# EasyEDA Pro project ProProject_2024省电H题小车_2024-08-25.epro

# Schematic 电赛小车底板原理图
Create Date: 2024-08-21; Page Name: P1; Project Name: 2024省电H题小车; Schematic Name: 电赛小车底板原理图; Update Date: 2024-08-22; Company: 华南师范大学; Drawed: Jacky_L; Page Size: A4; Version: V1.0
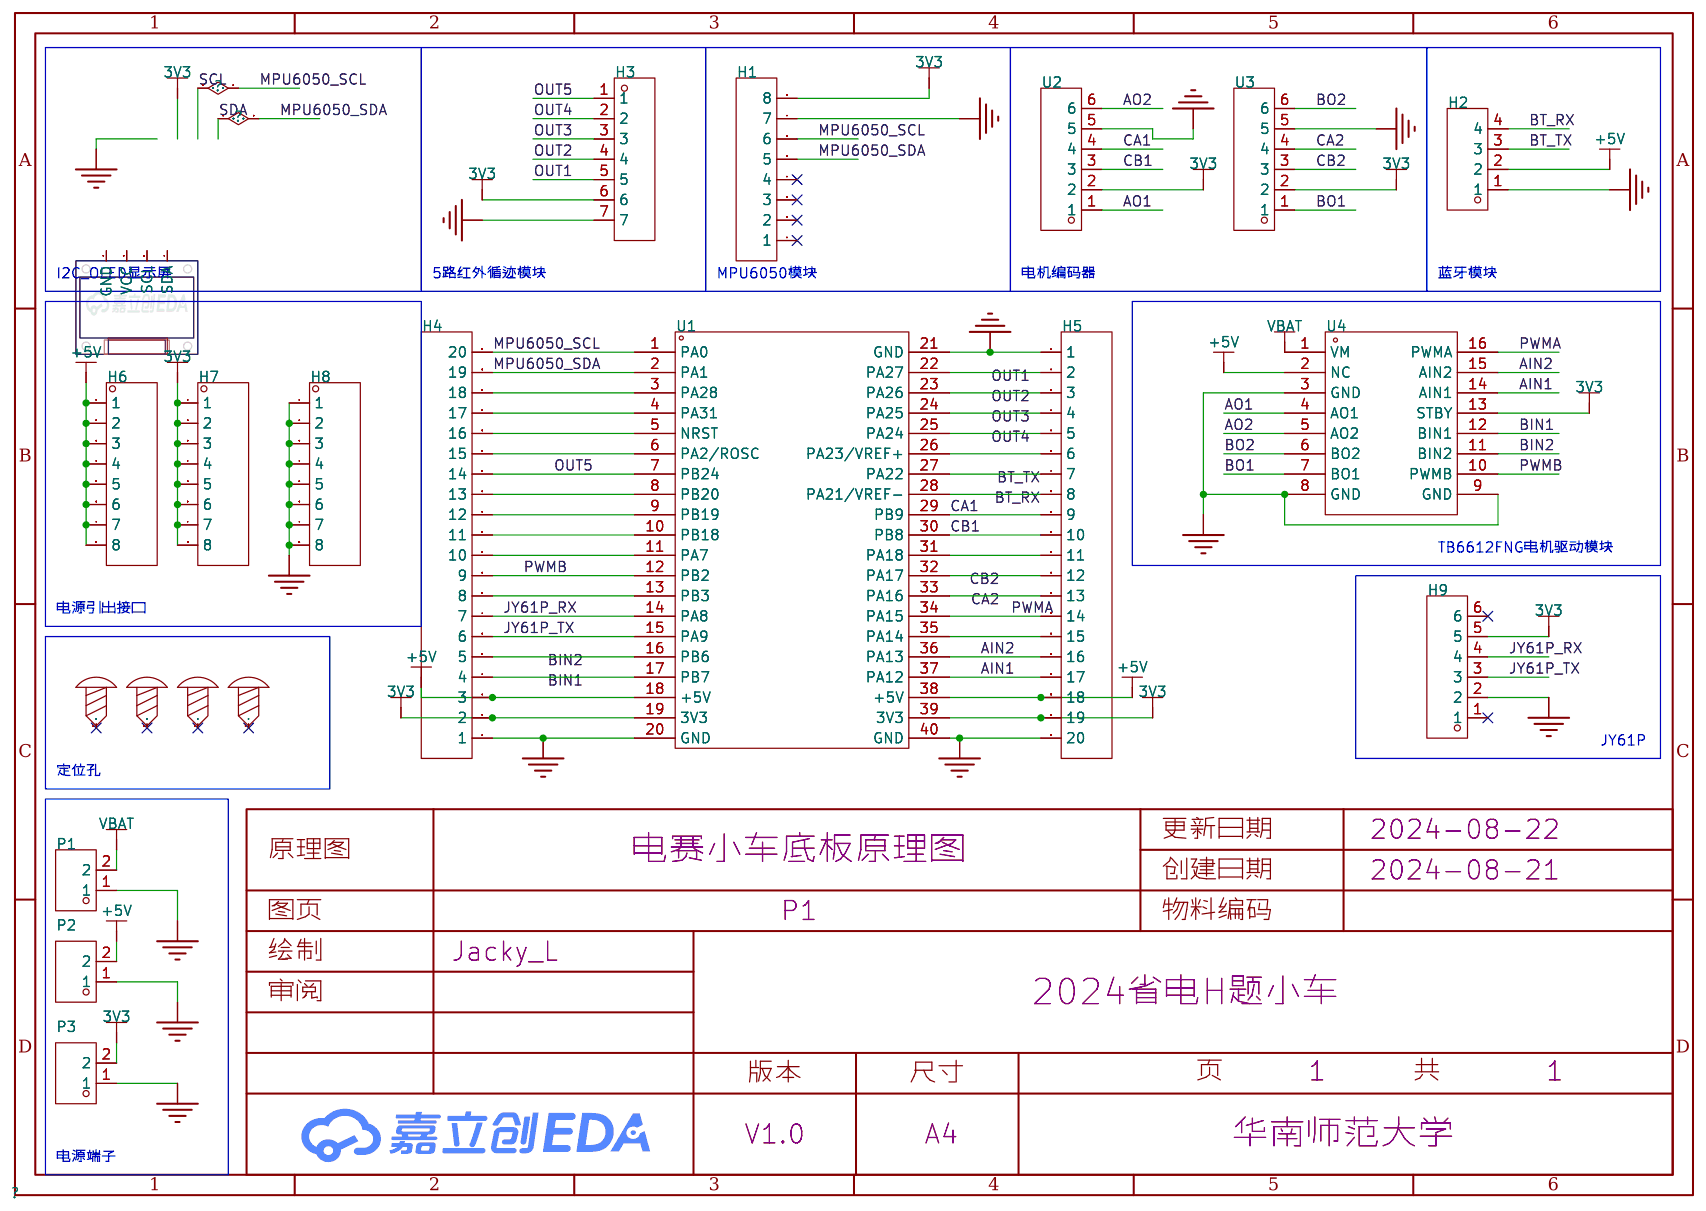
[diagram p0: schematic sheet]

## Parts
H1  -  [HDR-TH_8P-P2.54-V-F-1]
H2  -  [HDR-TH_4P-P2.54-V-F]
H3  -  [HDR-TH_7P-P2.54-V-M]
H4  -  [HDR-TH_20P-P2.54-V-F]
H5  -  [HDR-TH_20P-P2.54-V-F]
H6  -  [HDR-TH_8P-P2.54-V-M]
H7  -  [HDR-TH_8P-P2.54-V-M]
H8  -  [HDR-TH_8P-P2.54-V-M]
H9  -  [HDR-TH_6P-P2.54-V-F]
OLED  -  [0.96OLED_4P]
P1  KF301-2P接线端子  [CONN-TH_XY301V-A-5.0-2P]
P2  KF301-2P接线端子  [CONN-TH_XY301V-A-5.0-2P]
P3  KF301-2P接线端子  [CONN-TH_XY301V-A-5.0-2P]
SCREW1  -  [M3螺丝]
SCREW2  -  [M3螺丝]
SCREW3  -  [M3螺丝]
SCREW4  -  [M3螺丝]
U1  -  [立创地猛星MSPM0G3507开发板]
U2  ZX-XH2.54-6PZZ  [CONN-TH_6P-P2.50_ZX-XH2.54-6PZZ]
U3  ZX-XH2.54-6PZZ  [CONN-TH_6P-P2.50_ZX-XH2.54-6PZZ]
U4  -  [TB6612FNG成品板]

## Library data of the parts
H1 = HDR-F_2.54_1x8P: Supplier Part: C27438; Supplier Footprint: 插件
H2 = HDR-F_2.54_1x4P: Supplier Part: C2718488; Supplier Footprint: 插件
H3 = HDR-M_2.54_1x7P: Supplier Part: C492406; Supplier Footprint: 插件
H4 H5 = HDR-F_2.54_1x20P: Supplier Part: C50984; Supplier Footprint: 插件
H6-H8 = HDR-M_2.54_1x8P: Supplier Part: C124381; Supplier Footprint: 插件
H9 = HDR-F_2.54_1x6P: Supplier Part: C40877; Supplier Footprint: 插件
OLED = 0.96OLED模块_4P: Supplier Footprint: 插件
P1-P3 = KF301-2P接线端子: Supplier Part: C9900016950; Supplier Footprint: CK301-2P; JLCPCB Part Class: 扩展库; Supplier: LCSC
SCREW1-SCREW4 = M3螺丝: Supplier Footprint: 插件
U1 = 立创地猛星MSPM0G3507最小系统板
U2 U3 = ZX-XH2.54-6PZZ: 插针结构:1x6P;间距:2.54mm;安装方式:直插;参考系列:XH;总PIN数:6P;排数:1;每排PIN数:6;行距:-;额定电流:3A;触头材质:黄铜;触头镀层:锡;工作温度范围:-25℃~+85℃;; Supplier Part: C7429636; Manufacturer: Megastar(兆星); Supplier Footprint: 插件,P=2.54mm; JLCPCB Part Class: 扩展库; Datasheet: https://atta.szlcsc.com/upload/public/pdf/source/20230619/1243AD0A516E39CD3D274D8985780568.pdf; Supplier: LCSC; Pins Structure: 1x6P; Pitch: 2.54mm; Mounting Style: 直插; Reference Series: XH; Number of Pins: 6P; Number of Rows: 1; Number of PINs Per Row: 6; Current Rating (Max): 3A; Contact Material: 黄铜; Contact Plating: 锡; Operating Temperature Range: -25℃~+85℃
U4 = TB6612FNG成品板

## Nets
3V3: H1.8 H3.6 H4.2 H5.19 H7.1 H7.2 H7.3 H7.4 H7.5 H7.6 H7.7 H7.8 H9.5 P3.2 U1.19(3V3) U1.39(3V3) U2.2 U3.2 U4.13(STBY)
+5V: H2.2 H4.3 H5.18 H6.1 H6.2 H6.3 H6.4 H6.5 H6.6 H6.7 H6.8 P2.2 U1.18(+5V) U1.38(+5V) U4.2(NC)
GND: H1.7 H2.1 H3.7 H4.1 H5.1 H5.20 H8.1 H8.2 H8.3 H8.4 H8.5 H8.6 H8.7 H8.8 H9.2 P1.1 P2.1 P3.1 U1.20(GND) U1.21(GND) U1.40(GND) U2.5 U3.5 U4.3(GND) U4.8(GND) U4.9(GND)
VBAT: P1.2 U4.1(VM)
AIN1: H5.17 U1.37(PA12) U4.14(AIN1)
AIN2: H5.16 U1.36(PA13) U4.15(AIN2)
AO1: U2.1 U4.4(AO1)
AO2: U2.6 U4.5(AO2)
BIN1: H4.4 U1.17(PB7) U4.12(BIN1)
BIN2: H4.5 U1.16(PB6) U4.11(BIN2)
BO1: U3.1 U4.7(BO1)
BO2: U3.6 U4.6(BO2)
BT_RX: H2.4 H5.8 U1.28(PA21/VREF-)
BT_TX: H2.3 H5.7 U1.27(PA22)
CA1: H5.9 U1.29(PB9) U2.4
CA2: H5.13 U1.33(PA16) U3.4
CB1: H5.10 U1.30(PB8) U2.3
CB2: H5.12 U1.32(PA17) U3.3
JY61P_RX: H4.7 H9.4 U1.14(PA8)
JY61P_TX: H4.6 H9.3 U1.15(PA9)
MPU6050_SCL: H1.6 H4.20 U1.1(PA0)
MPU6050_SDA: H1.5 H4.19 U1.2(PA1)
OUT1: H3.5 H5.2 U1.22(PA27)
OUT2: H3.4 H5.3 U1.23(PA26)
OUT3: H3.3 H5.4 U1.24(PA25)
OUT4: H3.2 H5.5 U1.25(PA24)
OUT5: H3.1 H4.14 U1.7(PB24)
PWMA: H5.14 U1.34(PA15) U4.16(PWMA)
PWMB: H4.9 U1.12(PB2) U4.10(PWMB)
$1N424: H5.15 U1.35(PA14)
$1N436: H5.11 U1.31(PA18)
$1N451: H5.6 U1.26(PA23/VREF+)
$1N2846: H4.8 U1.13(PB3)
$1N2850: H4.10 U1.11(PA7)
$1N2852: H4.11 U1.10(PB18)
$1N2854: H4.12 U1.9(PB19)
$1N2856: H4.13 U1.8(PB20)
$1N2860: H4.15 U1.6(PA2/ROSC)
$1N2862: H4.16 U1.5(NRST)
$1N2864: H4.17 U1.4(PA31)
$1N2866: H4.18 U1.3(PA28)

Not connected (* = marked no-connect by the designer): H1 1* 2* 3* 4*; H9 1* 6*; OLED 1(GND) 2(VCC) 3(SCL) 4(SDA); SCREW1 1*; SCREW2 1*; SCREW3 1*; SCREW4 1*

## Notes on the sheet
- I2C_OLED显示屏
- 5路红外循迹模块
- MPU6050模块
- 电机编码器
- 蓝牙模块
- TB6612FNG电机驱动模块
- 电源引出接口
- JY61P
- 定位孔
- 电源端子

# Board 电赛小车底版PCB
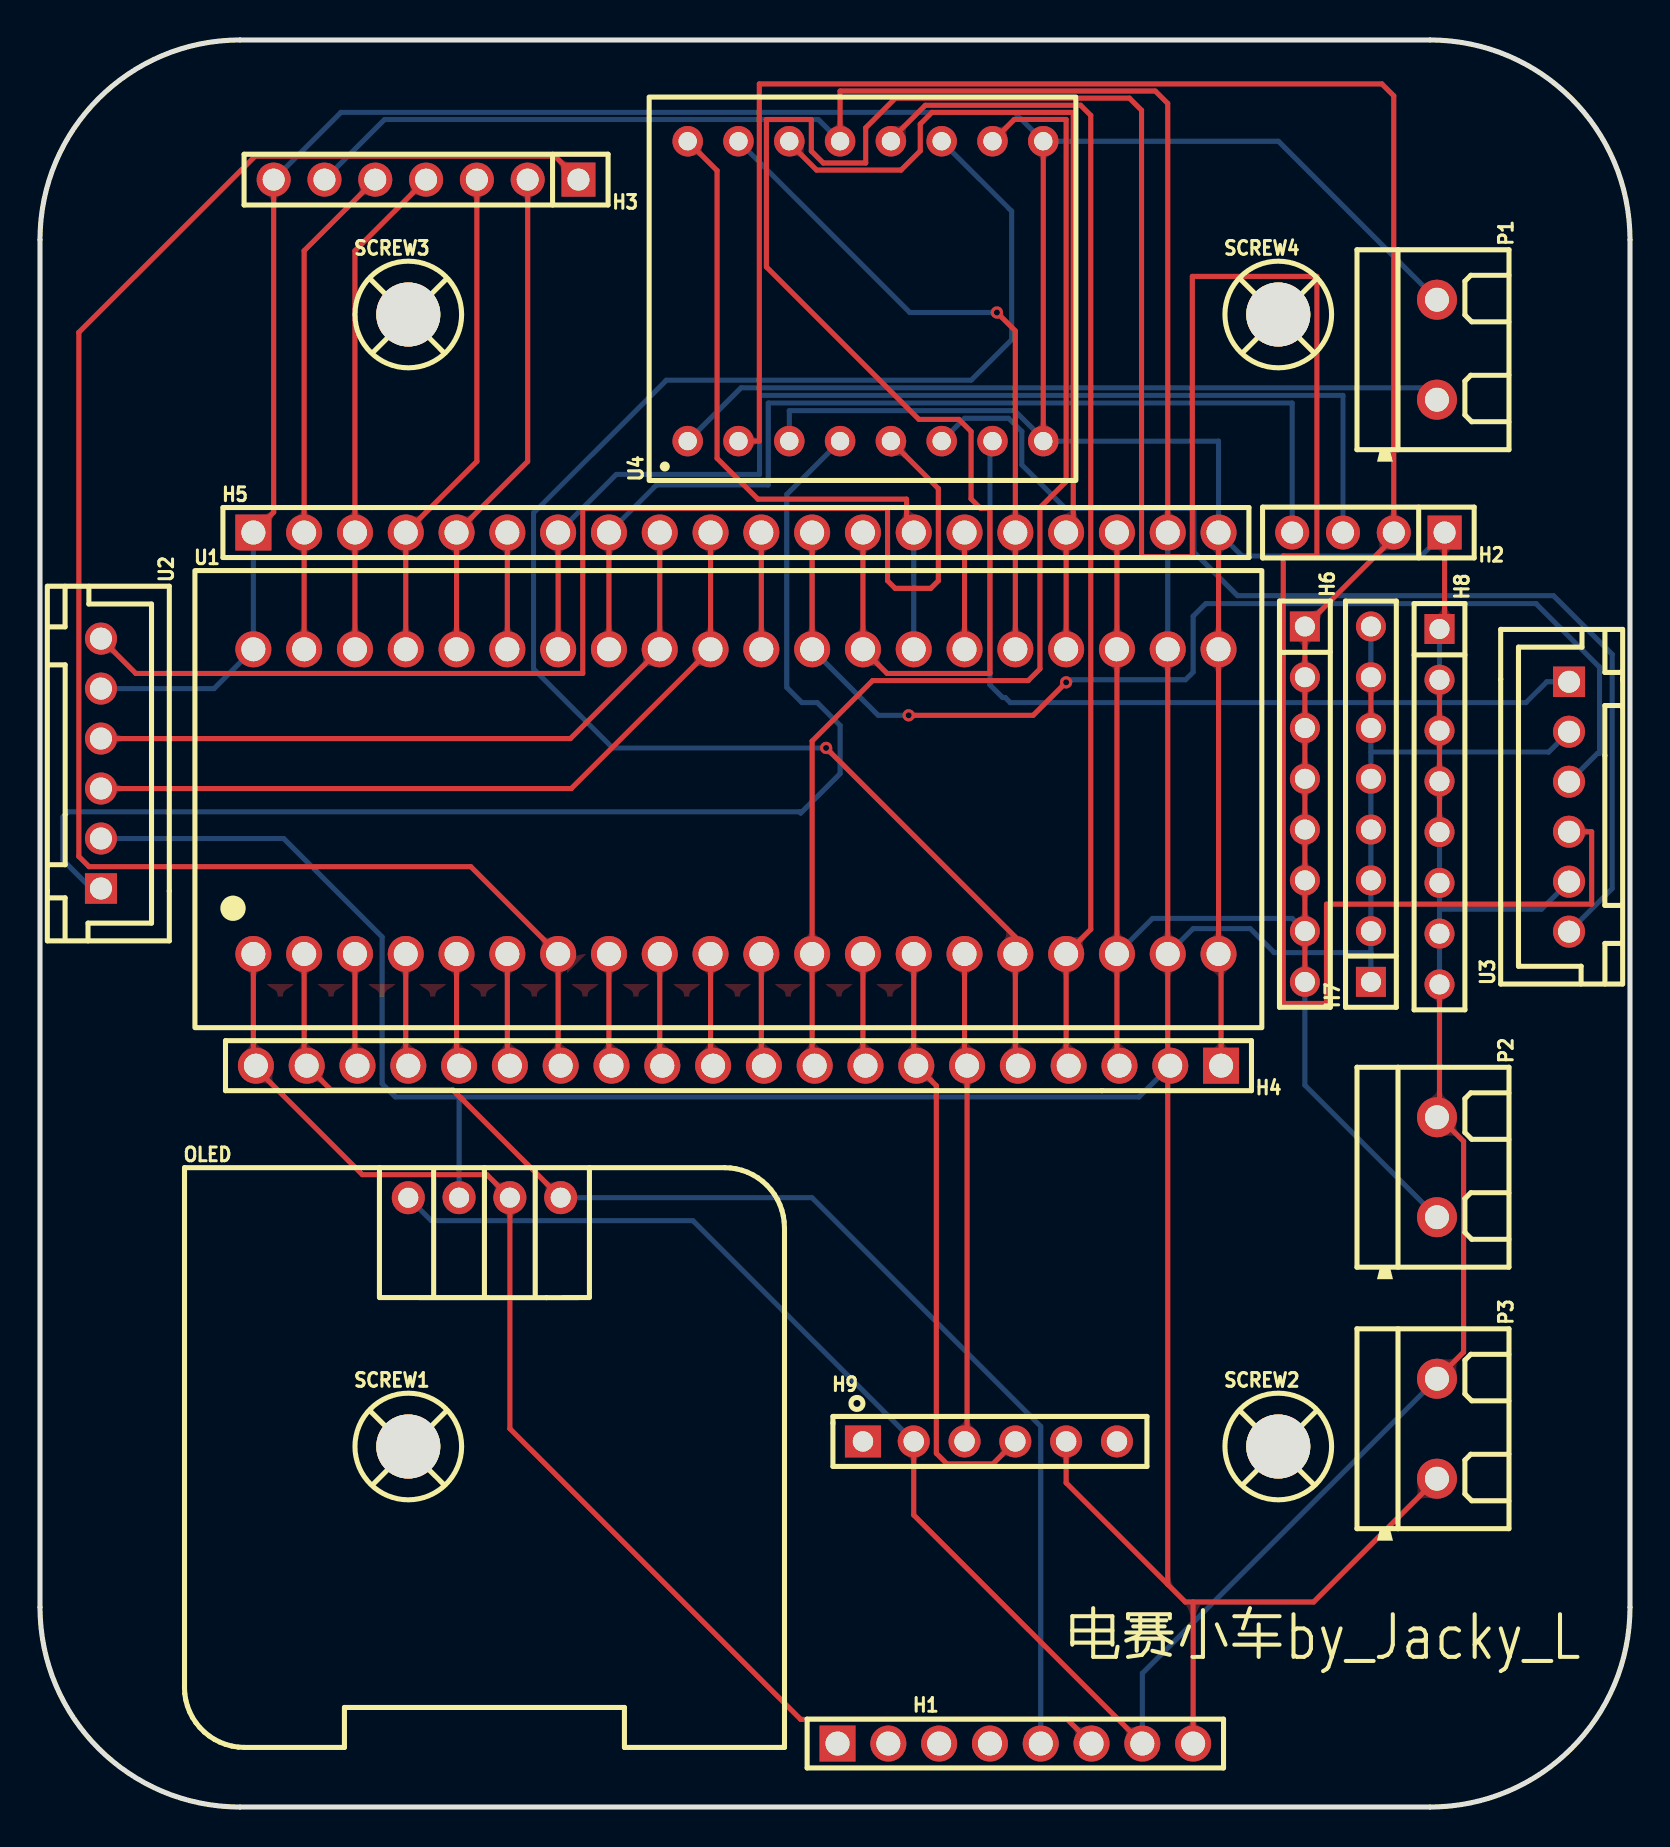
[diagram p1: board, top side]
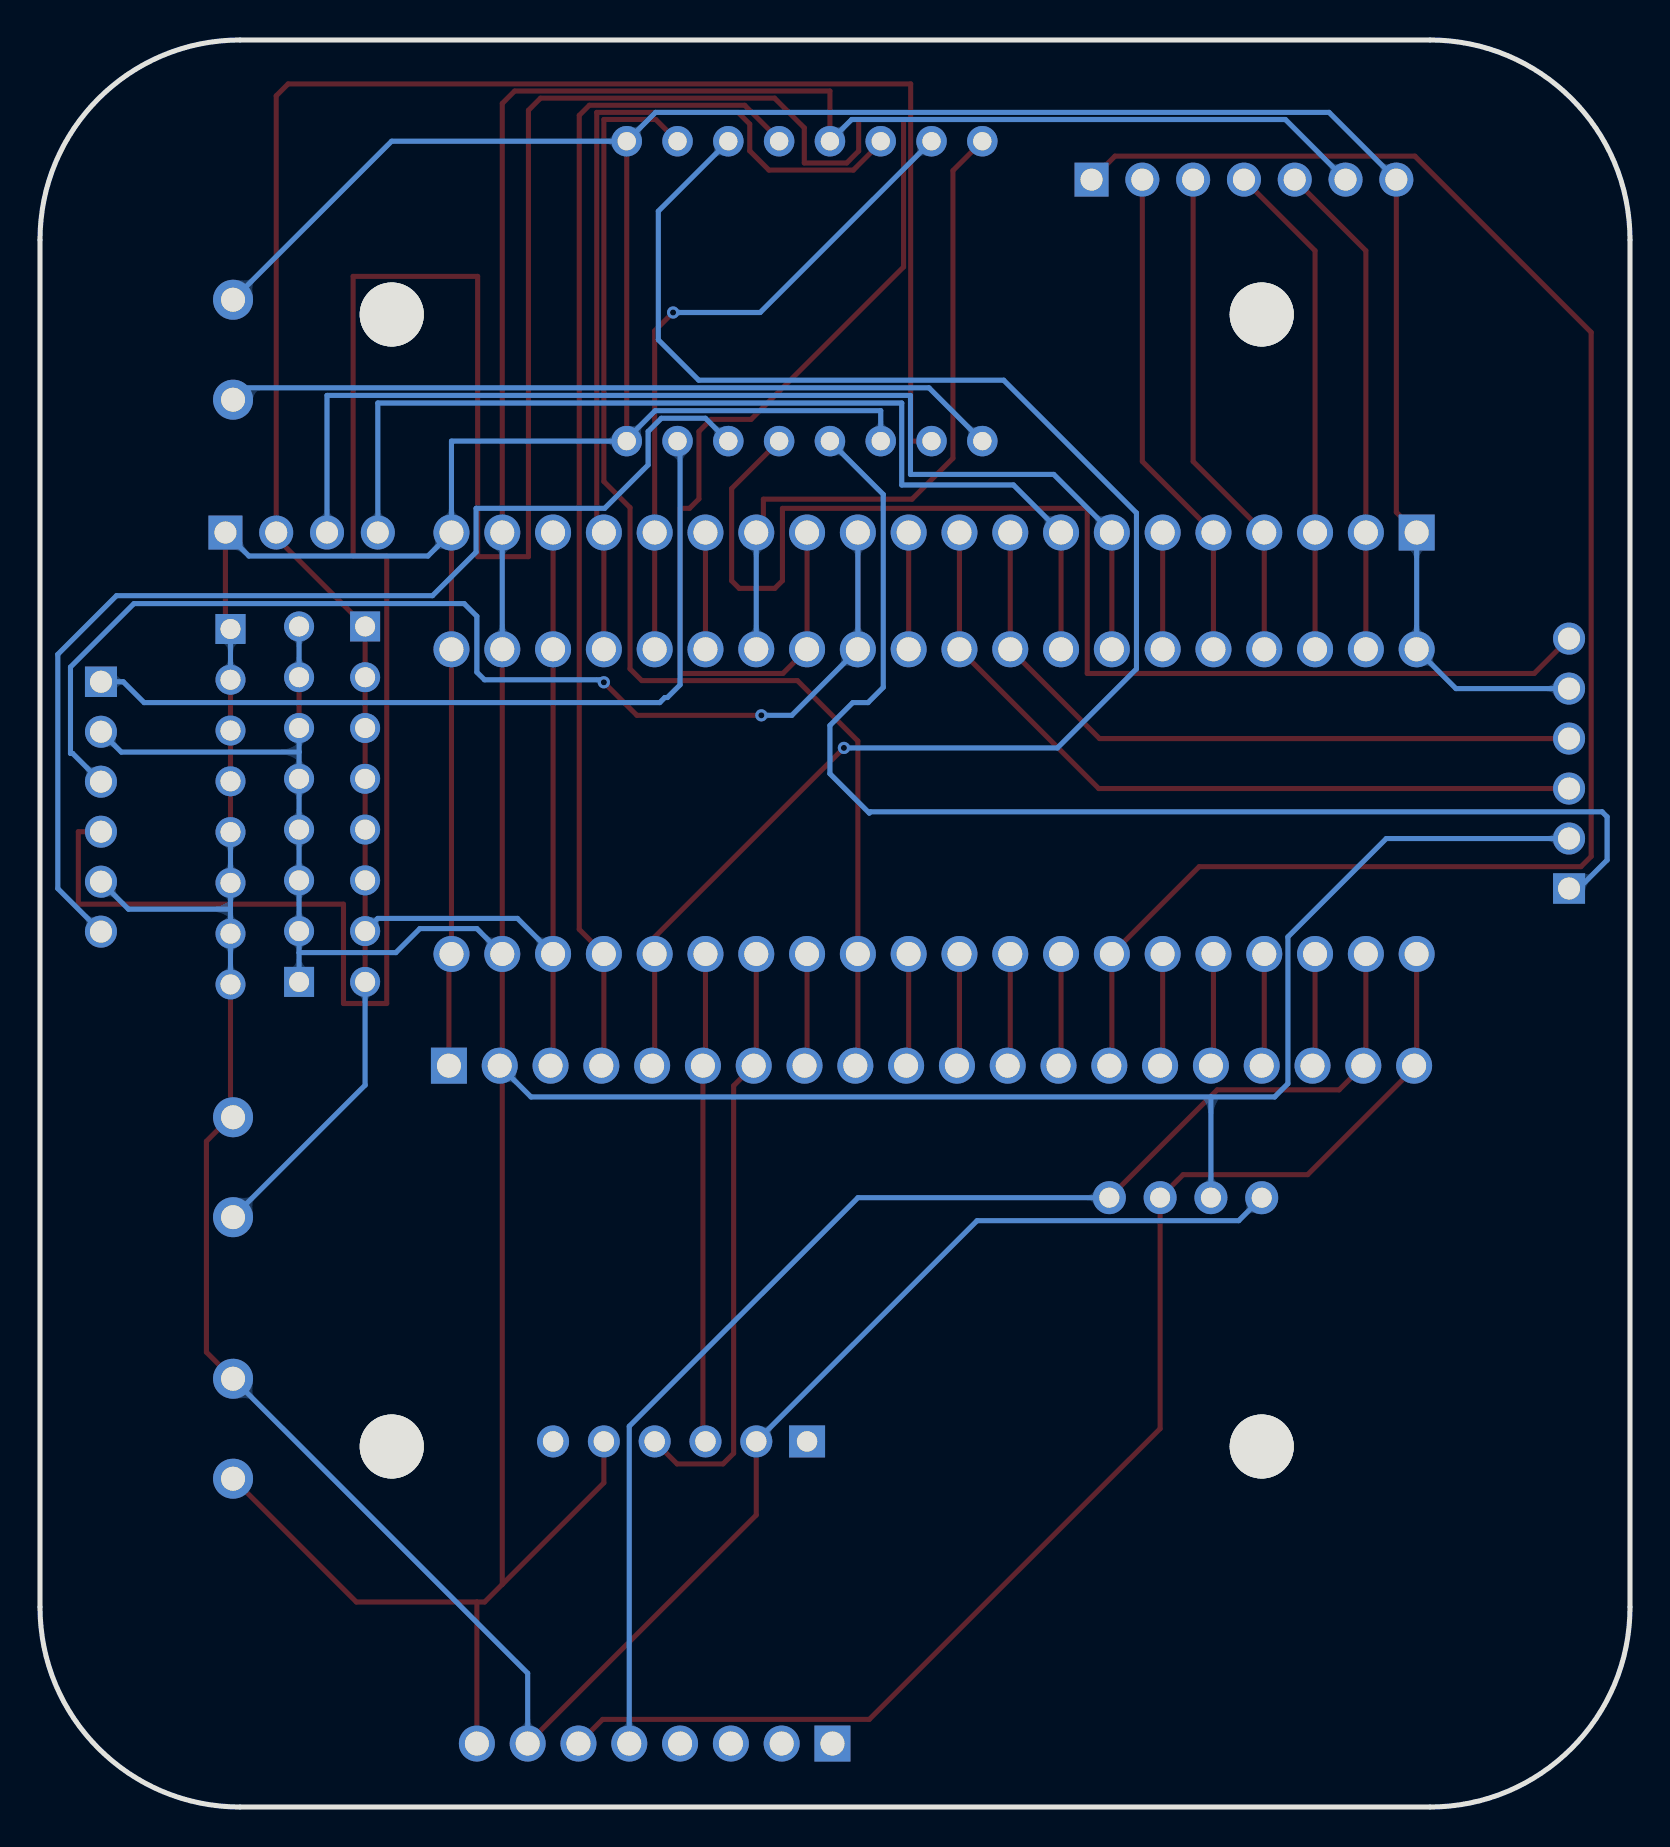
[diagram p2: board, bottom side, seen from below]

Outline 79.5 x 88.39 mm; copper layers: Top Layer, Bottom Layer. Coordinates in mm from the lower left corner of the outline.
Outline path: 0,78.39 0,10 arc(2.93,2.93) 10,0 69.5,0 arc(76.57,2.93) 79.5,10 79.5,78.39 arc(76.57,85.46) 69.5,88.39 10,88.39 arc(2.93,85.46) 0,78.39
Stack: Top Layer 0.035mm / Dielectric1 1.51mm FR4 er 4.5 / Bottom Layer 0.035mm

## Design rules (mm)
template: JLCPCB Capability(Two Layers Board)
spacing copperThickness1oz (default): track to track 0.102, other pairs 0.152 to 0.3
spacing copperThickness2oz: track to track 0.203, other pairs 0.152 to 0.3
track width copperThickness1oz (default): min 0.127, default 0.254, max 2.54
track width copperThickness2oz: min 0.203, default 0.254, max 2.54
differential pair differentialPair (default): width min 0.127, default 0.254, max 2.54; gap min 0.152, default 0.152
via viaSize (default): diameter min 0.5, default 0.61, max 10; hole min 0.3, default 0.305, max 6.3

## Placement (name value [footprint] x y rotation side)
H1  -  [HDR-TH_8P-P2.54-V-F-1]  48.77 3.17 0 top
H2  -  [HDR-TH_4P-P2.54-V-F]  66.42 63.75 180 top
H3  -  [HDR-TH_7P-P2.54-V-M]  19.3 81.41 180 top
H4  -  [HDR-TH_20P-P2.54-V-F]  34.92 37.08 180 top
H5  -  [HDR-TH_20P-P2.54-V-F]  34.8 63.75 0 top
H6  -  [HDR-TH_8P-P2.54-V-M]  63.25 50.16 270 top
H7  -  [HDR-TH_8P-P2.54-V-M]  66.55 50.16 90 top
H8  -  [HDR-TH_8P-P2.54-V-M]  69.98 50.04 270 top
H9  -  [HDR-TH_6P-P2.54-V-F]  47.5 18.29 0 top
OLED  -  [0.96OLED_4P]  22.23 30.48 0 top
P1  KF301-2P接线端子  [CONN-TH_XY301V-A-5.0-2P]  69.85 72.9 270 top
P2  KF301-2P接线端子  [CONN-TH_XY301V-A-5.0-2P]  69.85 32 270 top
P3  KF301-2P接线端子  [CONN-TH_XY301V-A-5.0-2P]  69.85 18.92 270 top
SCREW1  -  [M3螺丝]  18.48 17.97 0 top
SCREW2  -  [M3螺丝]  61.98 17.97 0 top
SCREW3  -  [M3螺丝]  18.48 74.6 0 top
SCREW4  -  [M3螺丝]  61.98 74.6 0 top
U1  -  [立创地猛星MSPM0G3507开发板]  10.67 42.67 0 top
U2  ZX-XH2.54-6PZZ  [CONN-TH_6P-P2.50_ZX-XH2.54-6PZZ]  3.05 52.2 270 top
U3  ZX-XH2.54-6PZZ  [CONN-TH_6P-P2.50_ZX-XH2.54-6PZZ]  76.45 50.04 90 top
U4  -  [TB6612FNG成品板]  32.39 68.33 90 top

## Footprints (pads in the part's own frame, mm; a bottom-side part is the same pattern mirrored in y, then rotated)
0.96OLED_4P
  round 1.65 hole 1: 1(-3.81,-0.002) 2(-1.27,0.002) 3(1.27,0.002) 4(3.81,0.002)
CONN-TH_6P-P2.50_ZX-XH2.54-6PZZ
  rect 1.524x1.6 hole 1.1: 1(6.25,0)
  round 1.6 hole 1.1: 2(3.75,0) 3(1.25,0) 4(-1.25,0) 5(-3.75,0) 6(-6.25,0)
CONN-TH_XY301V-A-5.0-2P
  round 2 hole 1.2: 1(-2.5,0) 2(2.5,0)
HDR-TH_4P-P2.54-V-F
  rect 1.7x1.7 hole 1.1: 1(-3.81,0)
  round 1.7 hole 1.1: 2(-1.27,0) 3(1.27,0) 4(3.81,0)
HDR-TH_6P-P2.54-V-F
  rect 1.8x1.6 hole 1.02: 1(-6.35,0)
  round 1.6 hole 1.02: 2(-3.81,0) 3(-1.27,0) 4(1.27,0) 5(3.81,0) 6(6.35,0)
HDR-TH_7P-P2.54-V-M
  rect 1.7x1.7 hole 1.1: 1(-7.62,0)
  round 1.7 hole 1.1: 2(-5.08,0) 3(-2.54,0) 4(0,0) 5(2.54,0) 6(5.08,0) 7(7.62,0)
HDR-TH_8P-P2.54-V-F-1
  rect 1.8x1.8 hole 1.2: 1(-8.89,0)
  round 1.8 hole 1.2: 2(-6.35,0) 3(-3.81,0) 4(-1.27,0) 5(1.27,0) 6(3.81,0) 7(6.35,0) 8(8.89,0)
HDR-TH_8P-P2.54-V-M
  rect 1.5x1.5 hole 1: 1(-8.89,0)
  round 1.5 hole 1: 2(-6.35,0) 3(-3.81,0) 4(-1.27,0) 5(1.27,0) 6(3.81,0) 7(6.35,0) 8(8.89,0)
HDR-TH_20P-P2.54-V-F
  rect 1.8x1.8 hole 1.2: 1(-24.13,0)
  round 1.8 hole 1.2: 2(-21.59,0) 3(-19.05,0) 4(-16.51,0) 5(-13.97,0) 6(-11.43,0) 7(-8.89,0) 8(-6.35,0) 9(-3.81,0) 10(-1.27,0) 11(1.27,0) 12(3.81,0) 13(6.35,0) 14(8.89,0) 15(11.43,0) 16(13.97,0) 17(16.51,0) 18(19.05,0) 19(21.59,0) 20(24.13,0)
M3螺丝
  round 3.2 hole 3.2: 1(-0.064,0.064)
TB6612FNG成品板
  round 1.524 hole 0.914: 1(0,0) 2(0,-2.54) 3(0,-5.08) 4(0,-7.62) 5(0,-10.16) 6(0,-12.7) 7(0,-15.24) 8(0,-17.78) 9(15.001,-17.78) 10(15.001,-15.24) 11(15.001,-12.7) 12(15.001,-10.16) 13(15.001,-7.62) 14(15.001,-5.08) 15(15.001,-2.54) 16(15.001,0)
立创地猛星MSPM0G3507开发板
  round 1.8 hole 1.2: 1(0,0) 2(2.54,0) 3(5.08,0) 4(7.62,0) 5(10.16,0) 6(12.7,0) 7(15.24,0) 8(17.78,0) 9(20.32,0) 10(22.86,0) 11(25.4,0) 12(27.94,0) 13(30.48,0) 14(33.02,0) 15(35.56,0) 16(38.1,0) 17(40.64,0) 18(43.18,0) 19(45.72,0) 20(48.26,0) 21(0,15.24) 22(2.54,15.24) 23(5.08,15.24) 24(7.62,15.24) 25(10.16,15.24) 26(12.7,15.24) 27(15.24,15.24) 28(17.78,15.24) 29(20.32,15.24) 30(22.86,15.24) 31(25.4,15.24) 32(27.94,15.24) 33(30.48,15.24) 34(33.02,15.24) 35(35.56,15.24) 36(38.1,15.24) 37(40.64,15.24) 38(43.18,15.24) 39(45.72,15.24) 40(48.26,15.24)

## Nets
As in the schematic, except:
3V3: H1.8 H3.6 H4.2 H5.19 H7.1 H7.2 H7.3 H7.4 H7.5 H7.6 H7.7 H7.8 H9.5 OLED.2 P3.2 U1.19 U1.39 U2.2 U3.2 U4.13
GND: H1.7 H2.1 H3.7 H4.1 H5.1 H5.20 H8.1 H8.2 H8.3 H8.4 H8.5 H8.6 H8.7 H8.8 H9.2 OLED.1 P1.1 P2.1 P3.1 U1.20 U1.21 U1.40 U2.5 U3.5 U4.3 U4.8 U4.9
MPU6050_SCL: H1.6 H4.20 OLED.3 U1.1
MPU6050_SDA: H1.5 H4.19 OLED.4 U1.2

Pads without a net: H1 1 2 3 4; H9 1 6; SCREW1 1; SCREW2 1; SCREW3 1; SCREW4 1

## Via types
v1: diameter 0.61, hole 0.305, Top Layer to Bottom Layer, 4 vias

## Routing (per net, layer and track width the routed paths; a pad name or vN(x,y) marks a point on that pad's centre or on a via; arc(x,y) is an arc through that point)
3V3: length 261.7
  Top Layer w0.254: H9.5 51.31,16.22 56.39,11.14 ; P3.2 63.68,10.26 57.66,10.26 ; H7.6 H7.7 ; 56.39,37.08 56.39,11.14 ; 56.39,37.08 H4.2 ; 56.39,37.08 U1.19 U1.39 ; 56.39,11.14 57.27,10.26 57.66,10.26 ; H5.19 56.39,85.22 55.77,85.84 40.01,85.84 U4.13 ; H1.8 57.66,10.26
  Bottom Layer w0.254: U2.2 12.18,48.45 17.11,43.52 17.11,36.18 17.77,35.52 20.95,35.52 ; U1.39 H5.19 ; H4.2 54.95,35.52 20.95,35.52 ; H7.7 H7.8 ; 66.55,42.74 61.71,42.74 60.51,43.94 57.66,43.94 U1.19 ; 66.55,42.74 H7.1 ; 66.55,42.74 H7.2 H7.3 H7.4 H7.5 66.55,52.77 ; 20.95,35.52 OLED.2 ; 66.55,52.77 H7.6 ; 66.55,52.77 75.44,52.77 U3.2 ; U4.13 38.92,84.41 17.23,84.41 14.22,81.41
+5V: length 148.7
  Top Layer w0.254: U4.2 35.97,68.33 35.97,86.19 67.09,86.19 67.69,85.6 H2.2 67.69,63.5 H6.1 H6.2 H6.3 H6.4 H6.5 H6.6 H6.7 H6.8 ; 53.85,63.75 U1.38 U1.18 53.85,37.21 H4.3
  Bottom Layer w0.254: U1.18 55.63,44.45 62.61,44.45 H6.7 ; H6.8 63.25,36.11 P2.2
GND: length 303.2
  Top Layer w0.254: H5.20 U1.40 U1.20 59.05,42.54 H4.1 ; H8.1 70.23,59.18 H2.1 ; 69.98,34.5 71.18,33.3 71.18,22.75 69.85,21.42 ; 69.98,34.5 P2.1 ; 69.98,34.5 H8.8 ; H8.5 H8.4 H8.3 H8.2 ; H9.2 43.69,14.6 H1.7 ; 10.67,63.75 11.68,64.77 H3.7 ; U4.9 U4.8
  Bottom Layer w0.254: 69.98,44.91 75.08,44.91 U3.5 ; 69.98,44.91 H8.7 H8.8 ; 69.98,44.91 H8.6 H8.5 ; U2.5 8.7,55.95 U1.21 10.67,63.75 ; OLED.1 19.56,29.33 32.64,29.33 H9.2 ; P1.1 61.92,83.33 U4.9 48.72,84.77 15.05,84.77 H3.7 ; 69.85,21.42 55.12,6.69 H1.7 ; H2.1 69.06,62.58 60.1,62.58 H5.20 58.93,68.33 U4.8 50.17,68.42 48.74,69.85 37.47,69.85 U4.3 ; H8.1 H8.2
VBAT: length 38.8
  Bottom Layer w0.254: P1.2 69.26,70.99 35.05,70.99 U4.1
AIN1: length 43.8
  Top Layer w0.254: U4.14 37.47,83.25 38.83,81.88 43.05,81.88 44.01,82.84 44.01,84.19 44.6,84.77 51.66,84.77 51.66,64.11 H5.17 U1.37
AIN2: length 33.7
  Top Layer w0.254: U1.36 H5.16 48.77,73.84 v1(47.85,74.76)
  Bottom Layer w0.254: U4.15 43.49,74.76 v1(47.85,74.76)
AO1: length 63.8
  Bottom Layer w0.254: U2.1 2.57,45.95 1.14,47.37 1.14,49.53 1.4,49.78 37.97,49.78 38.04,49.72 40.01,51.69 40.01,54.1 38.86,55.24 38.1,55.24 37.34,56.01 37.34,65.66 U4.4
AO2: length 62.8
  Top Layer w0.254: U2.6 4.79,56.7 27.14,56.7 27.14,64.96 42.38,64.96 42.38,61.34 42.76,60.96 44.54,60.96 44.92,61.34 44.92,65.95 U4.5
BIN1: length 59.1
  Top Layer w0.254: U4.12 42.55,83.4 44.27,85.13 52.03,85.13 52.54,84.62 52.54,43.9 U1.17 51.31,37.21 H4.4
BIN2: length 82.8
  Top Layer w0.254: H4.5 48.77,37.21 U1.16 48.77,43.52 v1(39.31,52.98)
  Bottom Layer w0.254: U4.11 48.58,79.83 48.58,73.4 46.56,71.37 31.32,71.37 24.68,64.73 24.68,56.93 28.63,52.98 v1(39.31,52.98)
BO1: length 42
  Bottom Layer w0.254: U4.7 47.5,68.2 47.5,56.13 48.13,55.5 48.26,55.5 48.51,55.24 74.3,55.24 75.34,56.29 U3.1
BO2: length 55.9
  Bottom Layer w0.254: U4.6 46.23,69.47 48.43,69.47 49.09,68.81 49.09,67.14 51.27,64.96 57.7,64.96 57.7,62.77 59.88,60.59 75.68,60.59 78.61,57.66 78.61,45.95 U3.6
BT_RX: length 51.6
  Top Layer w0.254: 28.45,57.91 28.45,63.75
  Bottom Layer w0.254: 28.45,63.75 30.83,66.13 36.41,66.13 36.41,70.23 62.61,70.23 H2.4
BT_TX: length 57.1
  Top Layer w0.254: U1.27 H5.7
  Bottom Layer w0.254: H5.7 28.81,66.66 35.98,66.66 35.98,70.61 65.15,70.61 H2.3
CA1: length 35.6
  Top Layer w0.254: H5.9 U1.29 26.52,53.45 U2.4
CA2: length 178
  Top Layer w0.254: U3.4 77.58,48.79 77.58,45.16 64.33,45.16 64.33,40.19 62.17,40.19 62.17,62.58 63.85,62.58 63.85,76.57 57.62,76.57 57.62,62.55 55.08,62.55 55.08,84.88 54.47,85.48 42.77,85.48 41.29,84 41.29,82.24 39.16,82.24 38.57,82.84 38.57,84.41 36.32,84.41 36.32,77.04 43.95,69.41 45.95,69.41 46.55,68.81 46.55,65.43 47.03,64.96 47.5,64.96 47.5,56.7 42.36,56.7 U1.33 H5.13
CB1: length 39.2
  Top Layer w0.254: U2.3 26.56,50.95 U1.30 H5.10
CB2: length 64.1
  Top Layer w0.254: U1.32 H5.12 ; v1(43.43,54.61) 49.66,54.61 v1(51.31,56.26)
  Bottom Layer w0.254: U3.3 77.87,52.7 77.98,52.7 77.98,57.02 74.8,60.2 58.29,60.2 57.66,59.56 57.66,56.77 57.28,56.39 51.44,56.39 v1(51.31,56.26) ; v1(43.43,54.61) 41.91,54.61 U1.32 H5.12
JY61P_RX: length 30.1
  Top Layer w0.254: H9.4 47.64,17.16 45.35,17.16 44.82,17.69 44.82,36.08 H4.7 43.69,37.21 U1.14
JY61P_TX: length 24.5
  Top Layer w0.254: U1.15 46.23,37.21 H4.6 46.36,18.41 H9.3
MPU6050_SCL: length 68.4
  Top Layer w0.254: 10.67,37.08 16.12,31.63 22.35,31.63 OLED.3 23.5,18.92 38.04,4.38 51.37,4.38 H1.6 ; 10.67,37.08 U1.1 ; 10.67,37.08 H4.20
MPU6050_SDA: length 65.7
  Top Layer w0.254: U1.2 13.21,37.21 H4.19 14.54,35.88 20.64,35.88 OLED.4
  Bottom Layer w0.254: H1.5 50.04,19.04 38.6,30.48 OLED.4
OUT1: length 25
  Top Layer w0.254: U1.22 H5.2 13.21,77.85 16.76,81.41
OUT2: length 25
  Top Layer w0.254: U1.23 15.75,77.85 H3.4
OUT3: length 25
  Top Layer w0.254: H3.3 21.84,67.31 18.29,63.75 U1.24
OUT4: length 25
  Top Layer w0.254: U1.25 H5.5 24.38,67.31 24.38,81.41
OUT5: length 87
  Top Layer w0.254: H4.14 25.91,37.21 U1.7 21.54,47.04 2.45,47.04 1.94,47.55 1.94,73.77 10.76,82.58 25.75,82.58 H3.1
PWMA: length 34.7
  Top Layer w0.254: U4.16 33.85,81.86 33.85,67.47 35.9,65.42 43.33,65.42 43.33,63.75 43.69,63.75
  Bottom Layer w0.254: U1.34 43.69,63.75
PWMB: length 61.3
  Top Layer w0.254: U4.10 48.71,84.41 51.31,84.41 51.31,66.31 50,65 50,56.93 49.41,56.35 41.63,56.35 38.61,53.32 U1.12 38.61,37.21 H4.9
$1N424: length 5.8
  Top Layer w0.254: U1.35 46.23,63.75
$1N436: length 5.8
  Top Layer w0.254: U1.31 36.07,63.75
$1N451: length 5.8
  Top Layer w0.254: U1.26 H5.6
$1N2846: length 5.6
  Top Layer w0.254: H4.8 41.15,37.21 U1.13
$1N2850: length 5.6
  Top Layer w0.254: H4.10 36.07,37.21 U1.11
$1N2852: length 5.6
  Top Layer w0.254: U1.10 33.53,37.21 H4.11
$1N2854: length 5.6
  Top Layer w0.254: H4.12 30.99,37.21 U1.9
$1N2856: length 5.6
  Top Layer w0.254: 28.45,42.67 28.45,37.21 H4.13
$1N2860: length 5.6
  Top Layer w0.254: U1.6 23.37,37.21 H4.15
$1N2862: length 5.6
  Top Layer w0.254: H4.16 20.83,37.21 U1.5
$1N2864: length 5.6
  Top Layer w0.254: U1.4 18.29,37.21 H4.17
$1N2866: length 5.6
  Top Layer w0.254: H4.18 15.75,37.21 U1.3

## Copper pours and planes (outline as drawn; the poured copper is in the pictures)
GND on Top Layer: -8.25,96.01 85.09,96.01 85.09,-4.19 -8.25,-4.19
GND on Bottom Layer: -12.57,97.79 88.14,97.79 88.14,-9.02 -12.57,-9.02

Small or netless copper shapes (teardrops, artwork), in the pictures only: 236 on Top Layer, 88 on Bottom Layer

## Text on the board
Top Silkscreen Layer: 电赛小车by_Jacky_L
